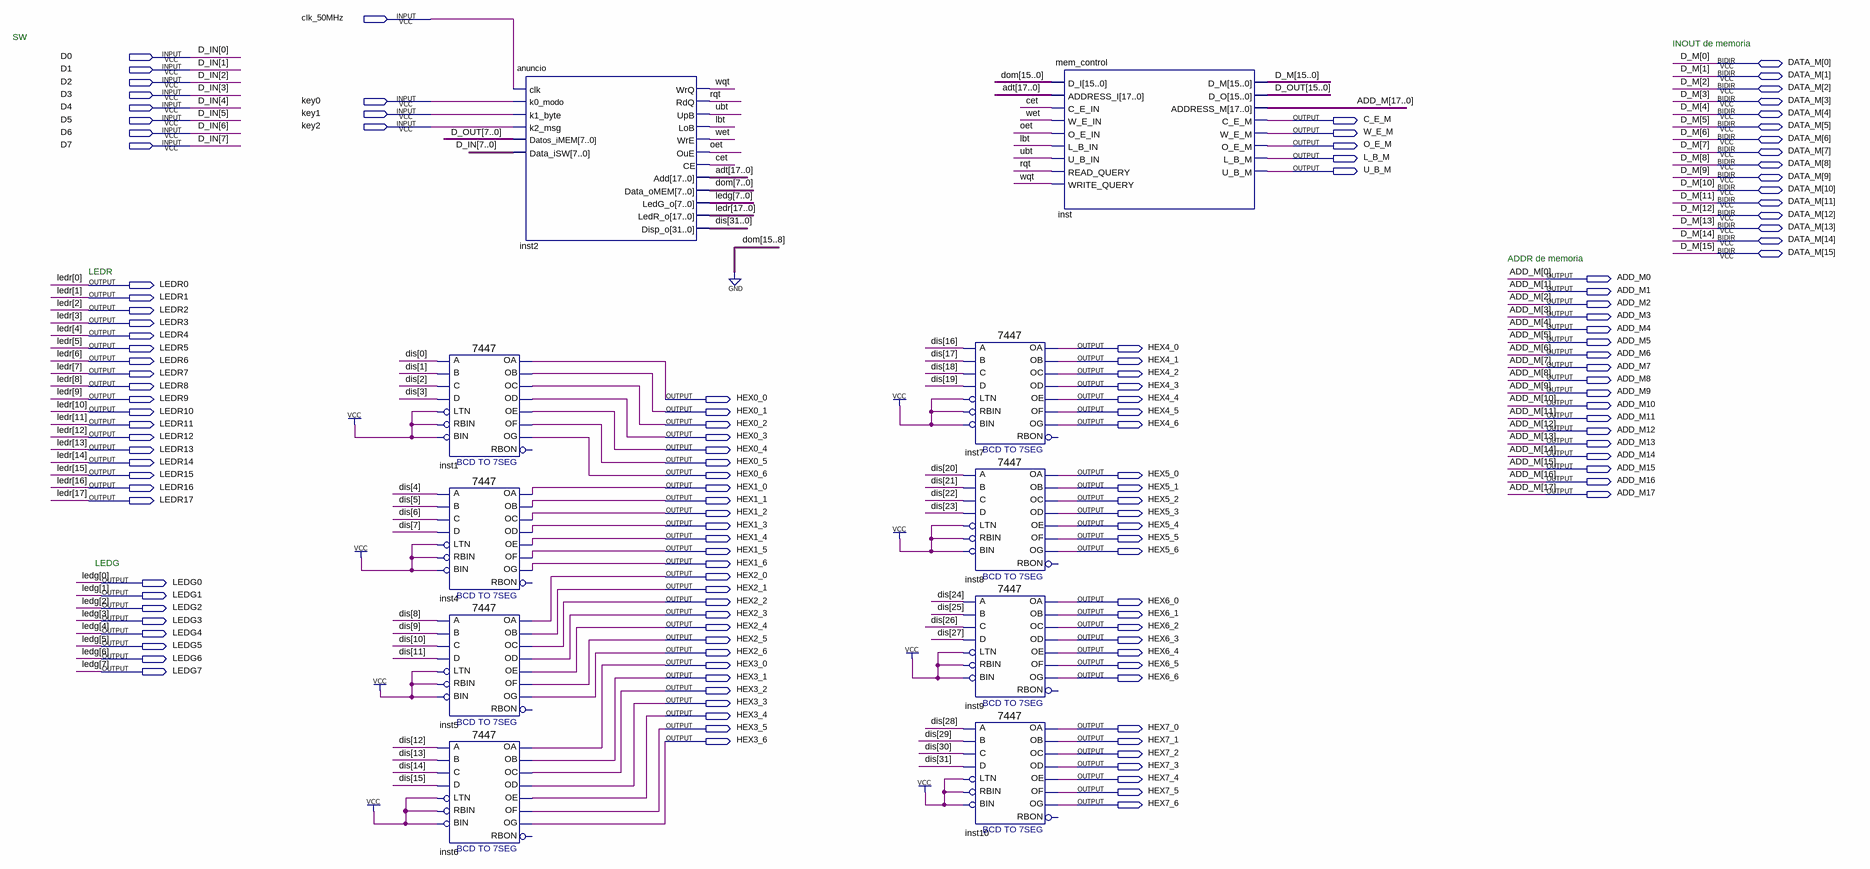
[diagram p0: schematic sheet]
// Quartus schematic memory_control_ISSI.bdf as structural Verilog: 10 symbols, 133 pins
module memory_control_ISSI (
  input  clk_50MHz,
  input  D0,
  input  D1,
  input  D2,
  input  D3,
  input  key0,
  input  D4,
  input  key1,
  input  D5,
  input  key2,
  input  D6,
  input  D7,
  inout  [15:0] DATA_M,
  output C_E_M,
  output W_E_M,
  output O_E_M,
  output L_B_M,
  output U_B_M,
  output ADD_M0,
  output LEDR0,
  output ADD_M1,
  output LEDR1,
  output ADD_M2,
  output LEDR2,
  output ADD_M3,
  output LEDR3,
  output ADD_M4,
  output LEDR4,
  output ADD_M5,
  output LEDR5,
  output HEX4_0,
  output ADD_M6,
  output LEDR6,
  output HEX4_1,
  output ADD_M7,
  output LEDR7,
  output HEX4_2,
  output ADD_M8,
  output LEDR8,
  output HEX4_3,
  output ADD_M9,
  output LEDR9,
  output HEX0_0,
  output HEX4_4,
  output ADD_M10,
  output LEDR10,
  output HEX0_1,
  output HEX4_5,
  output ADD_M11,
  output LEDR11,
  output HEX0_2,
  output HEX4_6,
  output ADD_M12,
  output LEDR12,
  output HEX0_3,
  output ADD_M13,
  output LEDR13,
  output HEX0_4,
  output ADD_M14,
  output LEDR14,
  output HEX0_5,
  output ADD_M15,
  output LEDR15,
  output HEX0_6,
  output HEX5_0,
  output ADD_M16,
  output LEDR16,
  output HEX1_0,
  output HEX5_1,
  output ADD_M17,
  output LEDR17,
  output HEX1_1,
  output HEX5_2,
  output HEX1_2,
  output HEX5_3,
  output HEX1_3,
  output HEX5_4,
  output HEX1_4,
  output HEX5_5,
  output HEX1_5,
  output HEX5_6,
  output HEX1_6,
  output HEX2_0,
  output LEDG0,
  output HEX2_1,
  output LEDG1,
  output HEX2_2,
  output HEX6_0,
  output LEDG2,
  output HEX2_3,
  output HEX6_1,
  output LEDG3,
  output HEX2_4,
  output HEX6_2,
  output LEDG4,
  output HEX2_5,
  output HEX6_3,
  output LEDG5,
  output HEX2_6,
  output HEX6_4,
  output LEDG6,
  output HEX3_0,
  output HEX6_5,
  output LEDG7,
  output HEX3_1,
  output HEX6_6,
  output HEX3_2,
  output HEX3_3,
  output HEX3_4,
  output HEX3_5,
  output HEX7_0,
  output HEX3_6,
  output HEX7_1,
  output HEX7_2,
  output HEX7_3,
  output HEX7_4,
  output HEX7_5,
  output HEX7_6
);

  wire cet, lbt, oet, rqt, ubt, wet, wqt;
  wire [7:0] dom;
  wire [15:0] D_OUT;
  wire [17:0] adt;
  wire [31:0] dis;

  \7447  inst1 (
    .LTN(1'b1), .B(dis[1]), .C(dis[2]), .D(dis[3]), .RBIN(1'b1), .BIN(1'b1), .A(dis[0]), .OB(HEX0_1),
    .OC(HEX0_2), .OE(HEX0_4), .OD(HEX0_3), .OF(HEX0_5), .OG(HEX0_6), .OA(HEX0_0));  // open: RBON
  \7447  inst4 (
    .LTN(1'b1), .B(dis[5]), .C(dis[6]), .D(dis[7]), .RBIN(1'b1), .BIN(1'b1), .A(dis[4]), .OB(HEX1_1),
    .OC(HEX1_2), .OE(HEX1_4), .OD(HEX1_3), .OF(HEX1_5), .OG(HEX1_6), .OA(HEX1_0));  // open: RBON
  \7447  inst5 (
    .LTN(1'b1), .B(dis[9]), .C(dis[10]), .D(dis[11]), .RBIN(1'b1), .BIN(1'b1), .A(dis[8]), .OB(HEX2_1),
    .OC(HEX2_2), .OE(HEX2_4), .OD(HEX2_3), .OF(HEX2_5), .OG(HEX2_6), .OA(HEX2_0));  // open: RBON
  \7447  inst6 (
    .LTN(1'b1), .B(dis[13]), .C(dis[14]), .D(dis[15]), .RBIN(1'b1), .BIN(1'b1), .A(dis[12]), .OB(HEX3_1),
    .OC(HEX3_2), .OE(HEX3_4), .OD(HEX3_3), .OF(HEX3_5), .OG(HEX3_6), .OA(HEX3_0));  // open: RBON
  anuncio inst2 (
    .clk(clk_50MHz), .k0_modo(key0), .k1_byte(key1), .k2_msg(key2), .Datos_iMEM(D_OUT[7:0]),
    .Data_iSW({D7, D6, D5, D4, D3, D2, D1, D0}), .WrQ(wqt), .RdQ(rqt), .UpB(ubt), .LoB(lbt), .WrE(wet),
    .OuE(oet), .CE(cet), .Add(adt), .Data_oMEM(dom),
    .LedG_o({LEDG7, LEDG6, LEDG5, LEDG4, LEDG3, LEDG2, LEDG1, LEDG0}),
    .LedR_o({LEDR17, LEDR16, LEDR15, LEDR14, LEDR13, LEDR12, LEDR11, LEDR10, LEDR9, LEDR8, LEDR7, LEDR6, LEDR5, LEDR4, LEDR3, LEDR2, LEDR1, LEDR0}),
    .Disp_o(dis));
  \7447  inst7 (
    .LTN(1'b1), .B(dis[17]), .C(dis[18]), .D(dis[19]), .RBIN(1'b1), .BIN(1'b1), .A(dis[16]), .OB(HEX4_1),
    .OC(HEX4_2), .OE(HEX4_4), .OD(HEX4_3), .OF(HEX4_5), .OG(HEX4_6), .OA(HEX4_0));  // open: RBON
  \7447  inst8 (
    .LTN(1'b1), .B(dis[21]), .C(dis[22]), .D(dis[23]), .RBIN(1'b1), .BIN(1'b1), .A(dis[20]), .OB(HEX5_1),
    .OC(HEX5_2), .OE(HEX5_4), .OD(HEX5_3), .OF(HEX5_5), .OG(HEX5_6), .OA(HEX5_0));  // open: RBON
  \7447  inst9 (
    .LTN(1'b1), .B(dis[25]), .C(dis[26]), .D(dis[27]), .RBIN(1'b1), .BIN(1'b1), .A(dis[24]), .OB(HEX6_1),
    .OC(HEX6_2), .OE(HEX6_4), .OD(HEX6_3), .OF(HEX6_5), .OG(HEX6_6), .OA(HEX6_0));  // open: RBON
  \7447  inst10 (
    .LTN(1'b1), .B(dis[29]), .C(dis[30]), .D(dis[31]), .RBIN(1'b1), .BIN(1'b1), .A(dis[28]), .OB(HEX7_1),
    .OC(HEX7_2), .OE(HEX7_4), .OD(HEX7_3), .OF(HEX7_5), .OG(HEX7_6), .OA(HEX7_0));  // open: RBON
  mem_control inst (
    .D_I({{8{1'b0}}, dom}), .ADDRESS_I(adt), .C_E_IN(cet), .W_E_IN(wet), .O_E_IN(oet), .L_B_IN(lbt),
    .U_B_IN(ubt), .READ_QUERY(rqt), .WRITE_QUERY(wqt), .D_O(D_OUT),
    .ADDRESS_M({ADD_M17, ADD_M16, ADD_M15, ADD_M14, ADD_M13, ADD_M12, ADD_M11, ADD_M10, ADD_M9, ADD_M8, ADD_M7, ADD_M6, ADD_M5, ADD_M4, ADD_M3, ADD_M2, ADD_M1, ADD_M0}),
    .C_E_M(C_E_M), .W_E_M(W_E_M), .O_E_M(O_E_M), .L_B_M(L_B_M), .U_B_M(U_B_M), .D_M(DATA_M));

  // Other names for the same wires on the sheet: D_IN[7:0] = {D7, D6, D5, D4, D3, D2, D1, D0}; D_M[15:0] = DATA_M

  // Notes on the sheet:
  //   SW
  //   INOUT de memoria
  //   ADDR de memoria
  //   LEDR
  //   LEDG
endmodule
